# Altium schematic sheet ButtonsBuzzerLeds.SchDoc: Buzzer and LEDs
size A4; SheetNumber: 7; SheetTotal: 7
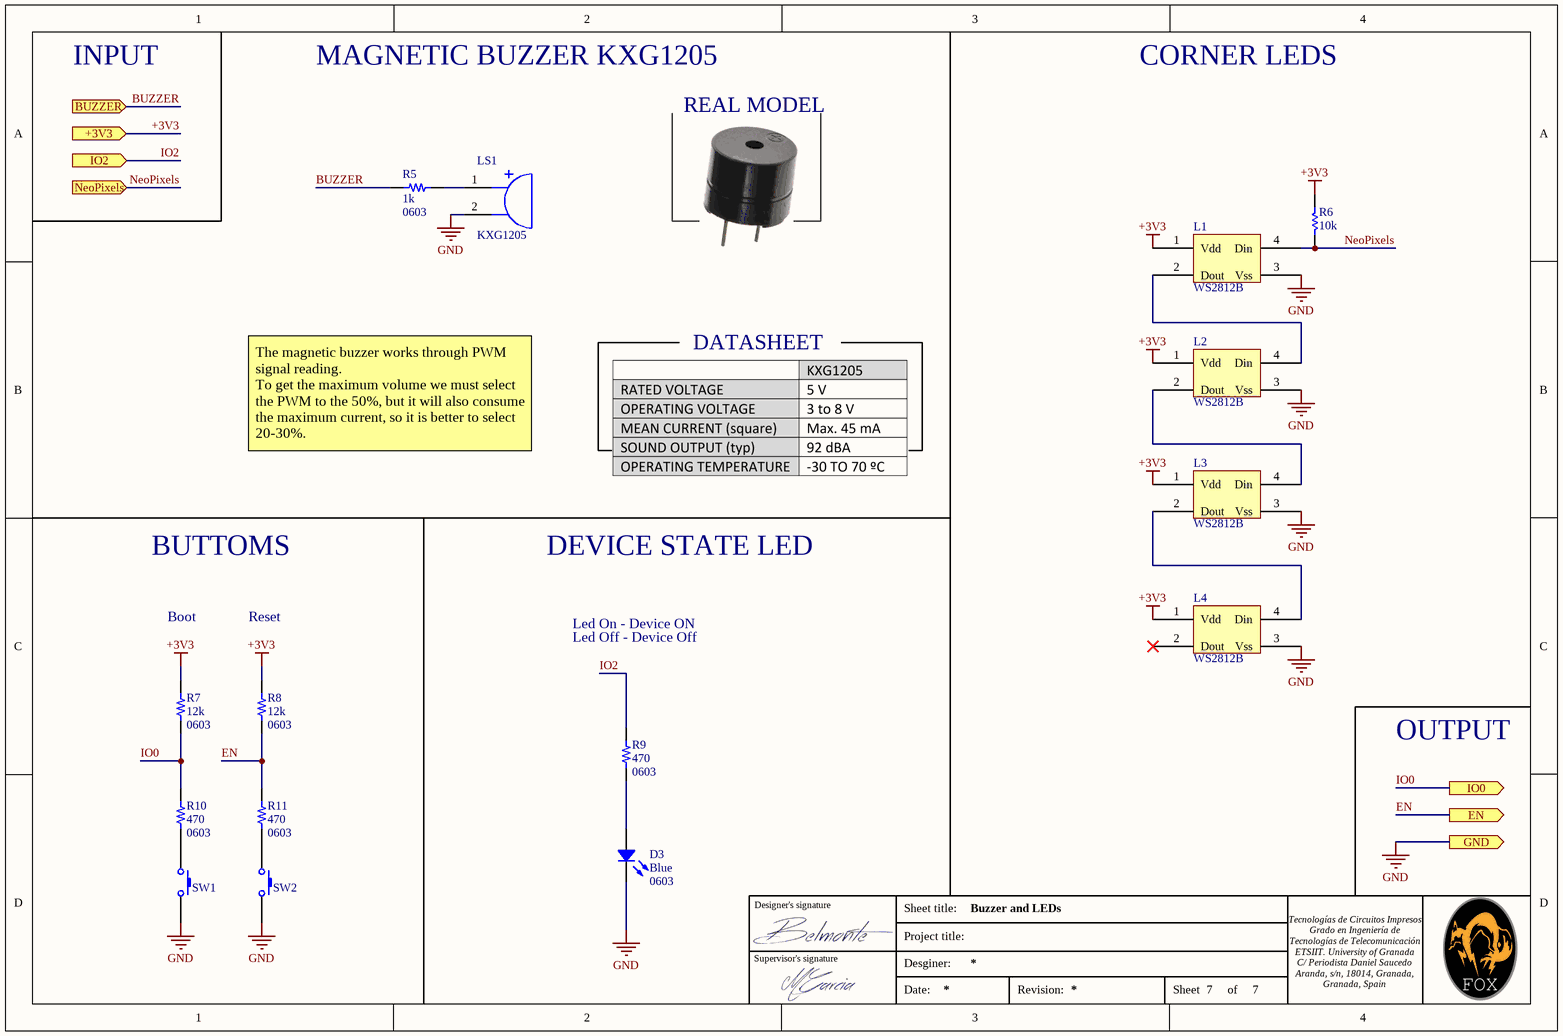
[diagram p0: ButtonsBuzzerLeds.SchDoc]

## Parts
D3  Blue  Size: 0603  [LED 0603_1608 BLUE]
L1  WS2812B  [WS2812B]
L2  WS2812B  [WS2812B]
L3  WS2812B  [WS2812B]
L4  WS2812B  [WS2812B]
LS1  KXG1205  [BUZZER]
R5  1k  Size: 0603  [RES 0603_1608]
R6  value 10k  [0805]
R7  12k  Size: 0603  [RES 0603_1608]
R8  12k  Size: 0603  [RES 0603_1608]
R9  470  Size: 0603  [RES 0603_1608]
R10  470  Size: 0603  [RES 0603_1608]
R11  470  Size: 0603  [RES 0603_1608]
SW1  FSMSMTR  [TECO-FSMSMTR_V]  (value not drawn)
SW2  FSMSMTR  [TECO-FSMSMTR_V]  (value not drawn)

## Ports
+3V3 (in), BUZZER (in), EN (out), GND (out), IO0 (out), IO2 (in), NeoPixels (in)

## Nets
+3V3: L1.1(Vdd) L2.1(Vdd) L3.1(Vdd) L4.1(Vdd) R6.1 R7.1 R8.1 ; port +3V3
GND: D3.2 L1.3(Vss) L2.3(Vss) L3.3(Vss) L4.3(Vss) LS1.2(-) SW1.2 SW2.2 ; port GND
BUZZER: R5.2 ; port BUZZER
EN: R8.2 R11.1 ; port EN
IO0: R7.2 R10.1 ; port IO0
IO2: R9.1 ; port IO2
NeoPixels: L1.4(Din) R6.2 ; port NeoPixels
NetD3_1: D3.1 R9.2
NetL1_2: L1.2(Dout) L2.4(Din)
NetL2_2: L2.2(Dout) L3.4(Din)
NetL3_2: L3.2(Dout) L4.4(Din)
NetLS1_1: LS1.1(+) R5.1
NetR10_2: R10.2 SW1.1
NetR11_2: R11.2 SW2.1

Not connected (* = marked no-connect by the designer): L4 2(Dout)*

## Notes on the sheet
- INPUT
- MAGNETIC BUZZER KXG1205
- REAL MODEL
- CORNER LEDS
- DATASHEET
- The magnetic buzzer works through PWM signal reading.
  To get the maximum volume we must select the PWM to the 50%, but it will also consume the maximum current, so it is better to select 20-30%.
- BUTTOMS
- DEVICE STATE LED
- Boot
- Reset
- Led On - Device ON
- Led Off - Device Off
- OUTPUT
- Designer's signature
- Sheet title:
- Supervisor's signature
- Project title:
- Desginer:
- Tecnologías de Circuitos Impresos
  Grado en Ingeniería de Tecnologías de Telecomunicación
  ETSIIT. University of Granada
  C/ Periodista Daniel Saucedo Aranda, s/n, 18014, Granada, Granada, Spain
- Date:
- Revision:
- Sheet
- of

## Library data of the parts
D3 = LED: LED BLUE 0603 SMD; Part Number: VLMB1300-GS08; Manufacturer: Vishay Semiconductor Opto Division; Configuration: Standard; Current - Test: 20mA; Lens Color: 1.00mm; Lens Size: 1.10mm x 0.80mm; Lens Style: Rectangle with Flat Top; Millicandela Rating: 104mcd; Viewing Angle: 130°; Voltage - Forward (Vf) (Typ): 3.3V; Wavelength - Dominant: 470nm; Wavelength - Peak: 468nm; Color: Blue; ComponentLink1Description: Datasheet; ComponentLink1URL: http://www.vishay.com/docs/82437/vlmo1300.pdf; ComponentLink2Description: DigiKey Link; ComponentLink2URL: http://digikey.com/product-detail/en/vishay-semiconductor-opto-division/VLMB1300-GS08/VLMB1300-GS08CT-ND/3025485; Device Package: 0603 (1608 Metric); Height (Max): 1.00mm; LastUpdated: 09/02/2020 01:20:26; Lifecycle Status: Active; Minimum Order: 1; Mounting Type: Surface Mount; Package / Case: 0603 (1608 Metric); Packaging: TapeAndReel; PartId: 785; Part Status: Active; Price: 0.08; Series: CHIPLED; Size / Dimension: 1.60mm L x 0.80mm W; Supplier 1: DigiKey; Supplier Part Number 1: VLMB1300-GS08CT-ND; Supplier Device Package: 0603; Value: Blue
LS1 = Buzzer
R5 = CRCW06031K00FKEAHP: RES SMD 1K OHM 1% 1/4W 0603; Manufacturer: Vishay Dale; Power (Watts): 0.25W, 1/4W; Resistance: 1 kOhms; Temperature Coefficient: ±100ppm/°C; Part Number: CRCW06031K00FKEAHP; ComponentLink1Description: Datasheet; ComponentLink1URL: http://www.vishay.com/docs/20043/crcwhpe3.pdf; ComponentLink2Description: DigiKey Link; ComponentLink2URL: http://digikey.com/product-detail/en/vishay-dale/CRCW06031K00FKEAHP/541-1.00KSCT-ND/2222766; Composition: Thick Film; Device Package: 0603 (1608 Metric); Features: Automotive AEC-Q200, Pulse Withstanding; Height - Seated (Max): 0.022" (0.55mm); LastUpdated: 09/02/2020 01:10:05; Lifecycle Status: Active; Minimum Order: 1; Number of Terminations: 2; Operating Temperature: -55°C ~ 155°C; Package / Case: 0603 (1608 Metric); Packaging: TapeAndReel; PartId: 14350; Part Status: Active; Price: 0.02; Ratings: AEC-Q200; Series: CRCW-HP; Size / Dimension: 0.063" L x 0.033" W (1.60mm x 0.85mm); Supplier 1: DigiKey; Supplier Part Number 1: 541-1.00KSCT-ND; Supplier Device Package: 0603; Tolerance: ±1%
R6 = Resistor: Supplier 1: Farnell; Supplier Part Number 1: 2358436
R7 R8 = RMCF0603JT12K0: RES 12K OHM 5% 1/10W 0603; Manufacturer: Stackpole Electronics Inc; Power (Watts): 0.1W, 1/10W; Resistance: 12 kOhms; Temperature Coefficient: ±200ppm/°C; Value: 12 kOhms; Part Number: RMCF0603JT12K0; ComponentLink1Description: Datasheet; ComponentLink1URL: https://www.seielect.com/catalog/sei-rmcf_rmcp.pdf; ComponentLink2Description: DigiKey Link; ComponentLink2URL: http://digikey.com/product-detail/en/stackpole-electronics-inc/RMCF0603JT12K0/RMCF0603JT12K0CT-ND/1943192; Composition: Thick Film; Device Package: 0603 (1608 Metric); Features: Automotive AEC-Q200; Height - Seated (Max): 0.022" (0.55mm); LastUpdated: 09/02/2020 01:10:24; Lifecycle Status: Active; Minimum Order: 1; Number of Terminations: 2; Operating Temperature: -55°C ~ 155°C; Package / Case: 0603 (1608 Metric); Packaging: CutTape; PartId: 5166; Part Status: Active; Price: 0.10; Ratings: AEC-Q200; Series: RMCF; Size / Dimension: 0.061" L x 0.031" W (1.55mm x 0.80mm); Supplier 1: DigiKey; Supplier Part Number 1: RMCF0603JT12K0CT-ND; Supplier Device Package: 0603; Tolerance: ±5%
R9-R11 = RMCF0603JT470R: RES 470 OHM 5% 1/10W 0603; Manufacturer: Stackpole Electronics Inc; Power (Watts): 0.1W, 1/10W; Resistance: 470 Ohms; Temperature Coefficient: ±200ppm/°C; Value: 470 Ohms; Part Number: RMCF0603JT470R; ComponentLink1Description: Datasheet; ComponentLink1URL: https://www.seielect.com/catalog/sei-rmcf_rmcp.pdf; ComponentLink2Description: DigiKey Link; ComponentLink2URL: http://digikey.com/product-detail/en/stackpole-electronics-inc/RMCF0603JT470R/RMCF0603JT470RCT-ND/1943166; Composition: Thick Film; Device Package: 0603 (1608 Metric); Features: Automotive AEC-Q200; Height - Seated (Max): 0.022" (0.55mm); LastUpdated: 09/02/2020 01:10:23; Lifecycle Status: Active; Minimum Order: 1; Number of Terminations: 2; Operating Temperature: -55°C ~ 155°C; Package / Case: 0603 (1608 Metric); Packaging: CutTape; PartId: 5857; Part Status: Active; Price: 0.10; Ratings: AEC-Q200; Series: RMCF; Size / Dimension: 0.061" L x 0.031" W (1.55mm x 0.80mm); Supplier 1: DigiKey; Supplier Part Number 1: RMCF0603JT470RCT-ND; Supplier Device Package: 0603; Tolerance: ±5%
SW1 SW2 = CMP-2000-07501-1: FSMSM Push Button Switch, 50 mA, -35 to 85 degC, 2-Pin SMD, RoHS, Tape and Reel; Manufacturer: TE Connectivity; Voltage Rating (DC): 24V; Electrical Life: 20000Cycles; Operating Force: 180gf; Switch Travel: 0.25mm; Contact Current Rating: 50mA; Case\/Package: SMD/SMT; Actuator Length: 1.07mm; Throw Configuration: SPST; Actuator Material: Polyamide; Contact Resistance: 100mOhm; Illumination Type: Illuminated; Max Voltage Rating (DC): 12V; Manufacturer URL: http://www.te.com/; Lead Free: LeadFree; Packaging: TapeandReel; Min Operating Temperature: -35degC; Mechanical Life: 20000Cycles; Mount: SurfaceMount; REACH SVHC: Unknown; Package Quantity: 1800; Package Reference: FSMSMTR; RoHSCompliant: true; Max Operating Temperature: 85degC; Orientation: Straight; ELV: Compliant; Datasheet URL: http://www.te.com/commerce/DocumentDelivery/DDEController?Action=showdoc&DocId=Customer+Drawing%7F1437566-3%7FC2%7Fpdf%7FEnglish%7FENG_CD_1437566-3_C2_1437566_3_1_c.dwg.pdf%7F1437566-4; Package Description: 2-Pin Surface Mount Device, Body 6 x 3.5 mm, Pitch 9.19 mm; Current Rating: 50mA; Contact Plating: Silver; Termination: GullWing; Datasheet Version: Rev. C2, 08/2014; Contact Material: Brass; Mounting Technology: SurfaceMount; Manufacturer Part Number: FSMSMTR